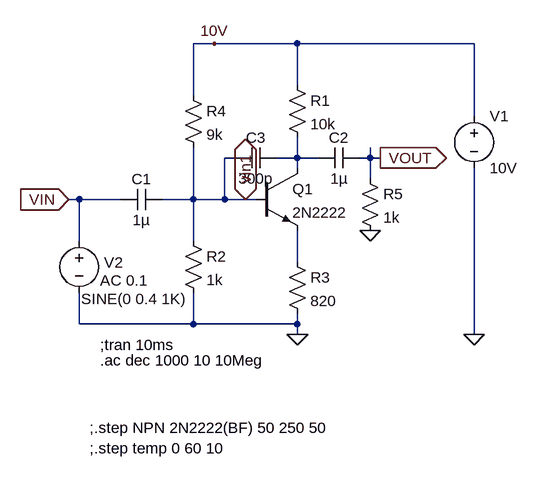
[diagram p0: schematic npn_essai3.asc]
npn_essai3.asc, the LTspice schematic file:
Version 4
SHEET 1 880 684
WIRE -32 48 -64 48
WIRE 96 48 -32 48
WIRE 368 48 96 48
WIRE 96 112 96 48
WIRE -64 128 -64 48
WIRE 368 160 368 48
WIRE 0 224 -16 224
WIRE 96 224 96 192
WIRE 96 224 64 224
WIRE 128 224 96 224
WIRE 208 224 208 208
WIRE 208 224 192 224
WIRE 224 224 208 224
WIRE 96 240 96 224
WIRE 208 256 208 224
WIRE -240 288 -256 288
WIRE -176 288 -240 288
WIRE -64 288 -64 208
WIRE -64 288 -112 288
WIRE -16 288 -16 224
WIRE -16 288 -64 288
WIRE 16 288 -16 288
WIRE 32 288 16 288
WIRE -240 352 -240 288
WIRE -64 352 -64 288
WIRE 96 384 96 336
WIRE -240 480 -240 432
WIRE -64 480 -64 432
WIRE -64 480 -240 480
WIRE 96 480 96 464
WIRE 96 480 -64 480
WIRE 96 496 96 480
WIRE 368 496 368 240
FLAG 96 496 0
FLAG 368 496 0
FLAG 224 224 VOUT
IOPIN 224 224 Out
FLAG -256 288 VIN
IOPIN -256 288 In
FLAG 16 288 vin1
IOPIN 16 288 BiDir
FLAG -32 48 10V
FLAG 208 336 0
SYMBOL npn 32 240 R0
SYMATTR InstName Q1
SYMATTR Value 2N2222
SYMBOL res 80 96 R0
SYMATTR InstName R1
SYMATTR Value 10k
SYMBOL voltage 368 144 R0
WINDOW 123 0 0 Left 0
WINDOW 39 0 0 Left 0
SYMATTR InstName V1
SYMATTR Value 10V
SYMBOL voltage -240 336 R0
WINDOW 3 3 105 Left 0
WINDOW 123 32 77 Left 0
WINDOW 39 0 0 Left 0
WINDOW 0 38 49 Left 0
SYMATTR Value SINE(0 0.4 1K)
SYMATTR Value2 AC 0.1
SYMATTR InstName V2
SYMBOL res 80 368 R0
SYMATTR InstName R3
SYMATTR Value 820
SYMBOL res -80 336 R0
SYMATTR InstName R2
SYMATTR Value 1k
SYMBOL res -80 112 R0
SYMATTR InstName R4
SYMATTR Value 9k
SYMBOL cap -112 272 R90
WINDOW 0 0 32 VBottom 0
WINDOW 3 32 32 VTop 0
SYMATTR InstName C1
SYMATTR Value 1µ
SYMBOL cap 192 208 R90
WINDOW 0 0 32 VBottom 0
WINDOW 3 32 32 VTop 0
SYMATTR InstName C2
SYMATTR Value 1µ
SYMBOL cap 64 208 R90
WINDOW 0 0 32 VBottom 0
WINDOW 3 32 32 VTop 0
SYMATTR InstName C3
SYMATTR Value 300p
SYMBOL res 192 240 R0
SYMATTR InstName R5
SYMATTR Value 1k
TEXT -208 512 Left 0 !;tran 10ms
TEXT -224 640 Left 0 !;.step NPN 2N2222(BF) 50 250 50\n;.step temp 0 60 10
TEXT -208 536 Left 0 !.ac dec 1000 10 10Meg

The netlist it stands for:
* npn_essai3.asc
Q1 N001 vin1 N002 0 2N2222
R1 10V N001 10k
V1 10V 0 10V
V2 VIN 0 SINE(0 0.4 1K) AC 0.1
R3 N002 0 820
R2 vin1 0 1k
R4 10V vin1 9k
C1 vin1 VIN 1µ
C2 VOUT N001 1µ
C3 N001 vin1 300p
R5 VOUT 0 1k
.model NPN NPN
.model PNP PNP
.lib standard.bjt
;tran 10ms
;.step NPN 2N2222(BF) 50 250 50
;.step temp 0 60 10
.ac dec 1000 10 10Meg
.backanno
.end